# EAGLE schematic Rocketv2Backup (EAGLE 8.5.2)

## Sheet 1 of 4
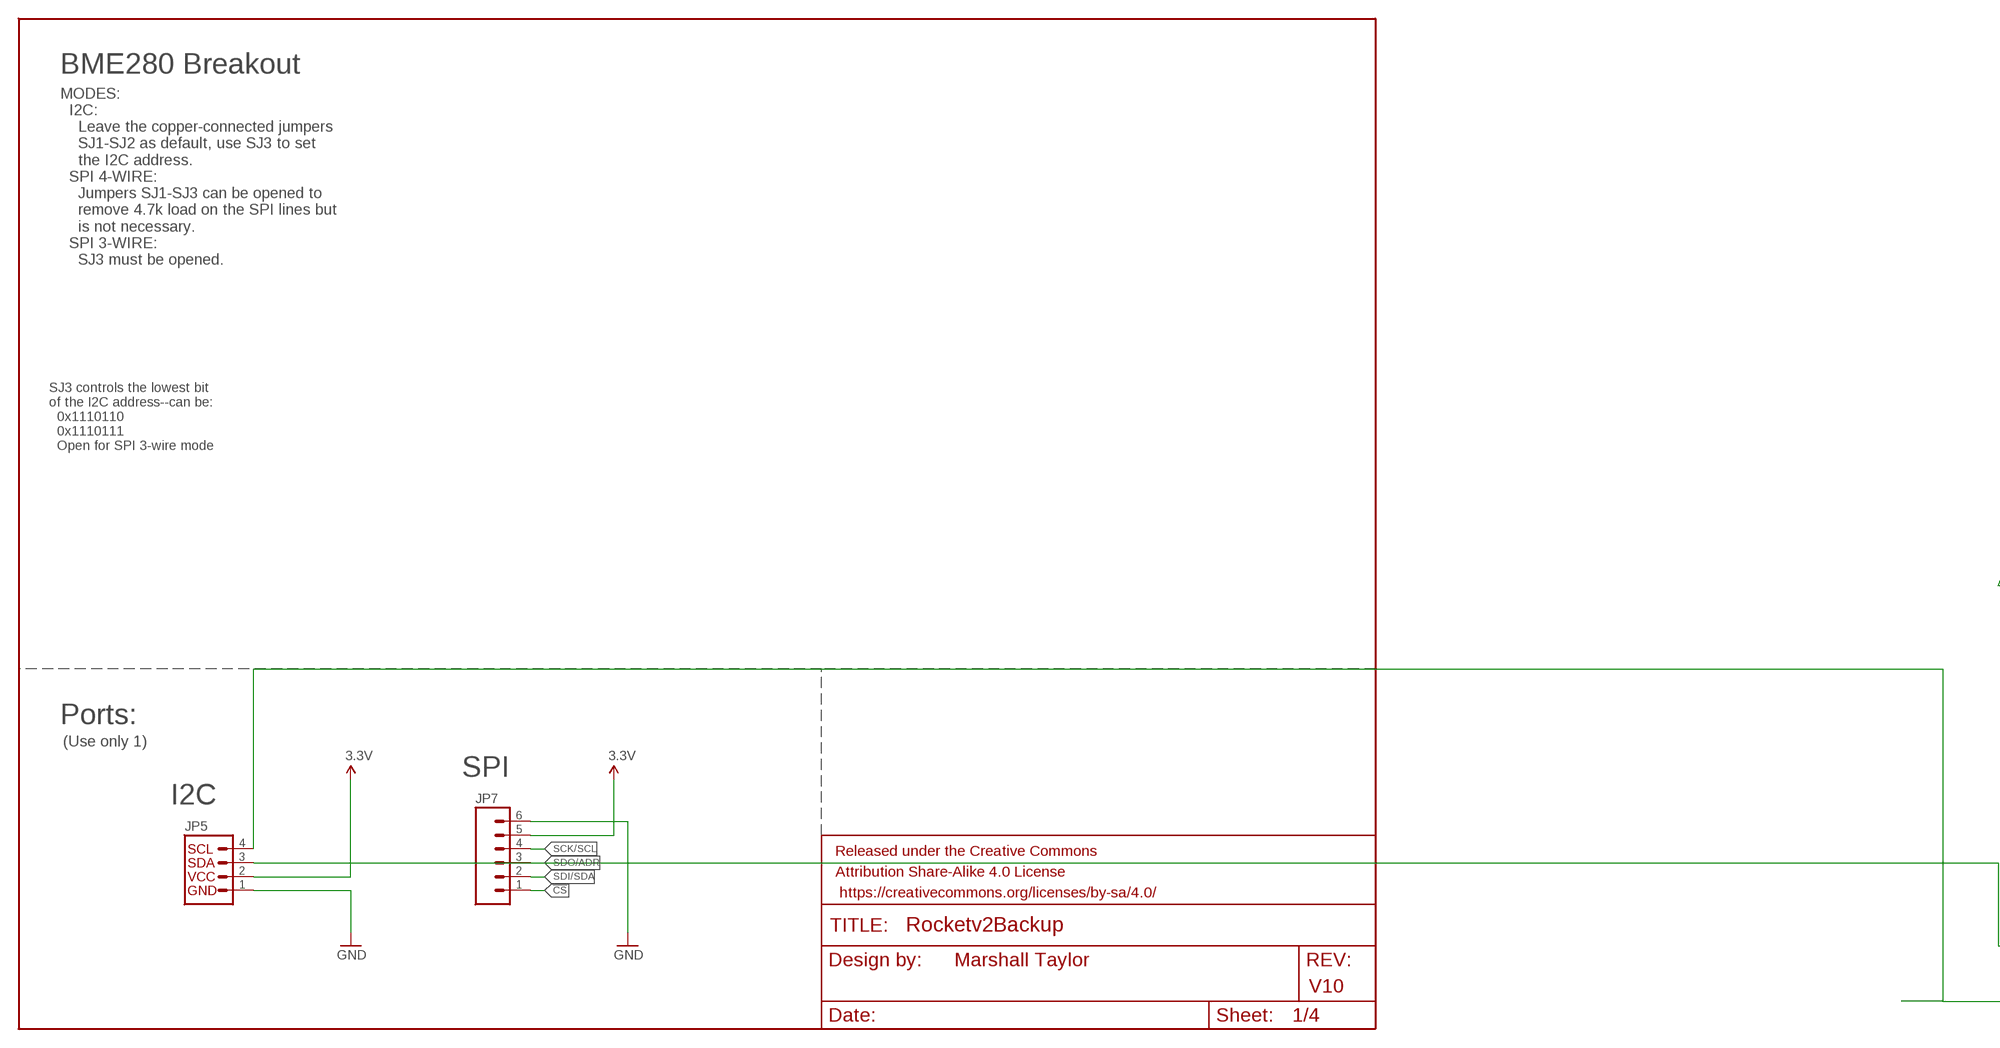
[diagram p0: schematic, sheet 1, part 1 of 2]
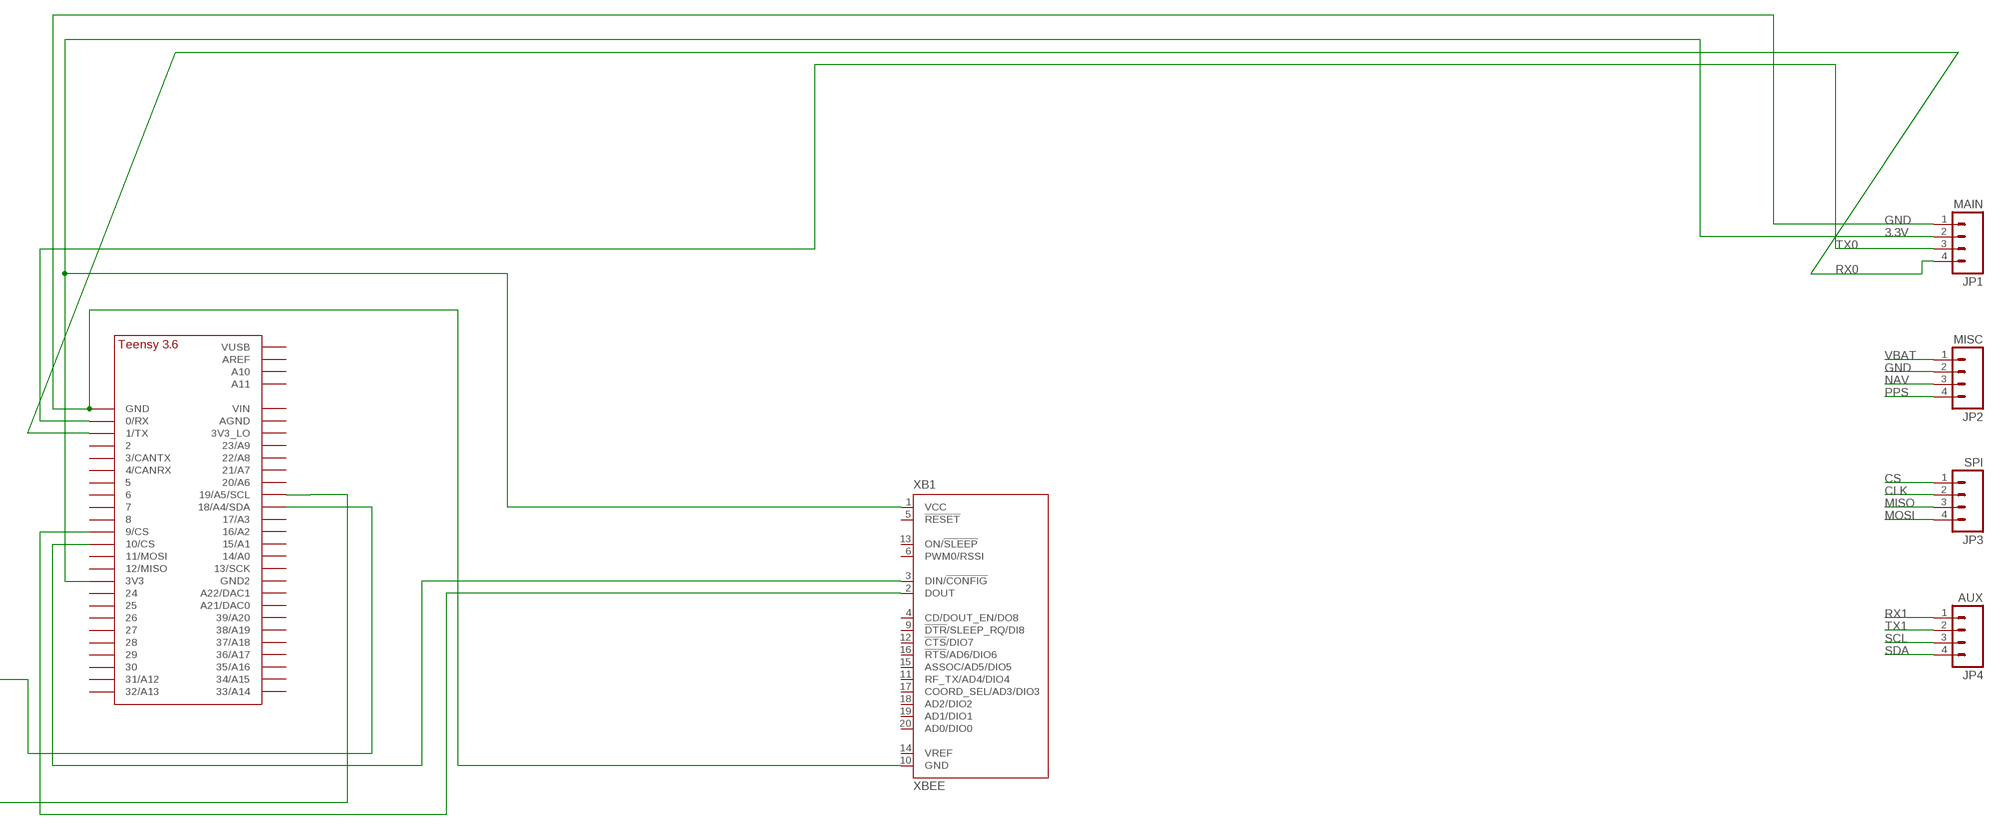
[diagram p1: schematic, sheet 1, part 2 of 2]

### Parts
FRAME3  FRAME-LETTER  [CREATIVE_COMMONS]
JP1  MAIN  M04PTH  [1X04]
JP2  MISC  M04PTH  [1X04]
JP3  SPI  M04PTH  [1X04]
JP4  AUX  M04PTH  [1X04]
JP5  I2C_STANDARD_NO_SILK  [1X04_NO_SILK]
JP7  M06NO_SILK_FEMALE_PTH  [1X06_NO_SILK]
U$1  TEENSY_3.5/3.6_BASIC  [TEENSY_3.5/3.6_BASIC]
XB1  XBEE  [XBEE]

### Nets
3.3V: JP1.2 JP5.2 JP7.5 U$1.3V3 XB1.1(VCC)
!CS: JP7.1
CLK: JP3.2
CS: JP3.1
GND: JP1.1 JP2.2 JP5.1 JP7.6 U$1.GND XB1.10(GND) ; also sheet 3
MISO: JP3.3
MOSI: JP3.4
N$5: JP5.4 U$1.19/A5/SCL
N$6: U$1.10/CS XB1.3(DIN/!CONFIG)
N$7: U$1.9/CS XB1.2(DOUT)
NAV: JP2.3
PPS: JP2.4
RX0: JP1.4 U$1.1/TX
RX1: JP4.1
SCK/SCL: JP7.4
SCL: JP4.3 ; also sheet 3
SDA: JP4.4 ; also sheet 3
SDI/SDA: JP5.3 JP7.2 U$1.18/A4/SDA
SDO/ADR: JP7.3
TX0: JP1.3 U$1.0/RX
TX1: JP4.2
VBAT: JP2.1
Unconnected: U$1.2 U$1.3/CANTX U$1.3V3_LO U$1.4/CANRX U$1.5 U$1.6 U$1.7 U$1.8 U$1.11/MOSI U$1.12/MISO U$1.13/SCK U$1.14/A0 U$1.15/A1 U$1.16/A2 U$1.17/A3 U$1.20/A6 U$1.21/A7 U$1.21/DAC0(A21/DAC0) U$1.22/A8 U$1.23/A9 U$1.24 U$1.25 U$1.26 U$1.27 U$1.28 U$1.29 U$1.30 U$1.31/A12 U$1.32/A13 U$1.33/A14 U$1.34/A15 U$1.35/A16 U$1.36/A17 U$1.37/A18 U$1.38/A19 U$1.39/A20 U$1.A10 U$1.A11 U$1.A22/DAC1 U$1.AGND U$1.AREF U$1.GND2 U$1.VIN U$1.VUSB XB1.4(CD/DOUT_EN/DO8) XB1.5(!RESET) XB1.6(PWM0/RSSI) XB1.9(!DTR!/SLEEP_RQ/DI8) XB1.11(RF_TX/AD4/DIO4) XB1.12(!CTS!/DIO7) XB1.13(ON/!SLEEP) XB1.14(VREF) XB1.15(ASSOC/AD5/DIO5) XB1.16(!RTS!/AD6/DIO6) XB1.17(COORD_SEL/AD3/DIO3) XB1.18(AD2/DIO2) XB1.19(AD1/DIO1) XB1.20(AD0/DIO0)

### Notes on the sheet
- BME280 Breakout
- MODES:
    I2C:
      Leave the copper-connected jumpers
      SJ1-SJ2 as default, use SJ3 to set
      the I2C address.
    SPI 4-WIRE:
      Jumpers SJ1-SJ3 can be opened to 
      remove 4.7k load on the SPI lines but
      is not necessary.
    SPI 3-WIRE:
      SJ3 must be opened.
- SJ3 controls the lowest bit
  of the I2C address--can be:
    0x1110110
    0x1110111
    Open for SPI 3-wire mode
- Ports:
- (Use only 1)
- SPI
- I2C
- Marshall Taylor
- V10

## Sheet 2 of 4
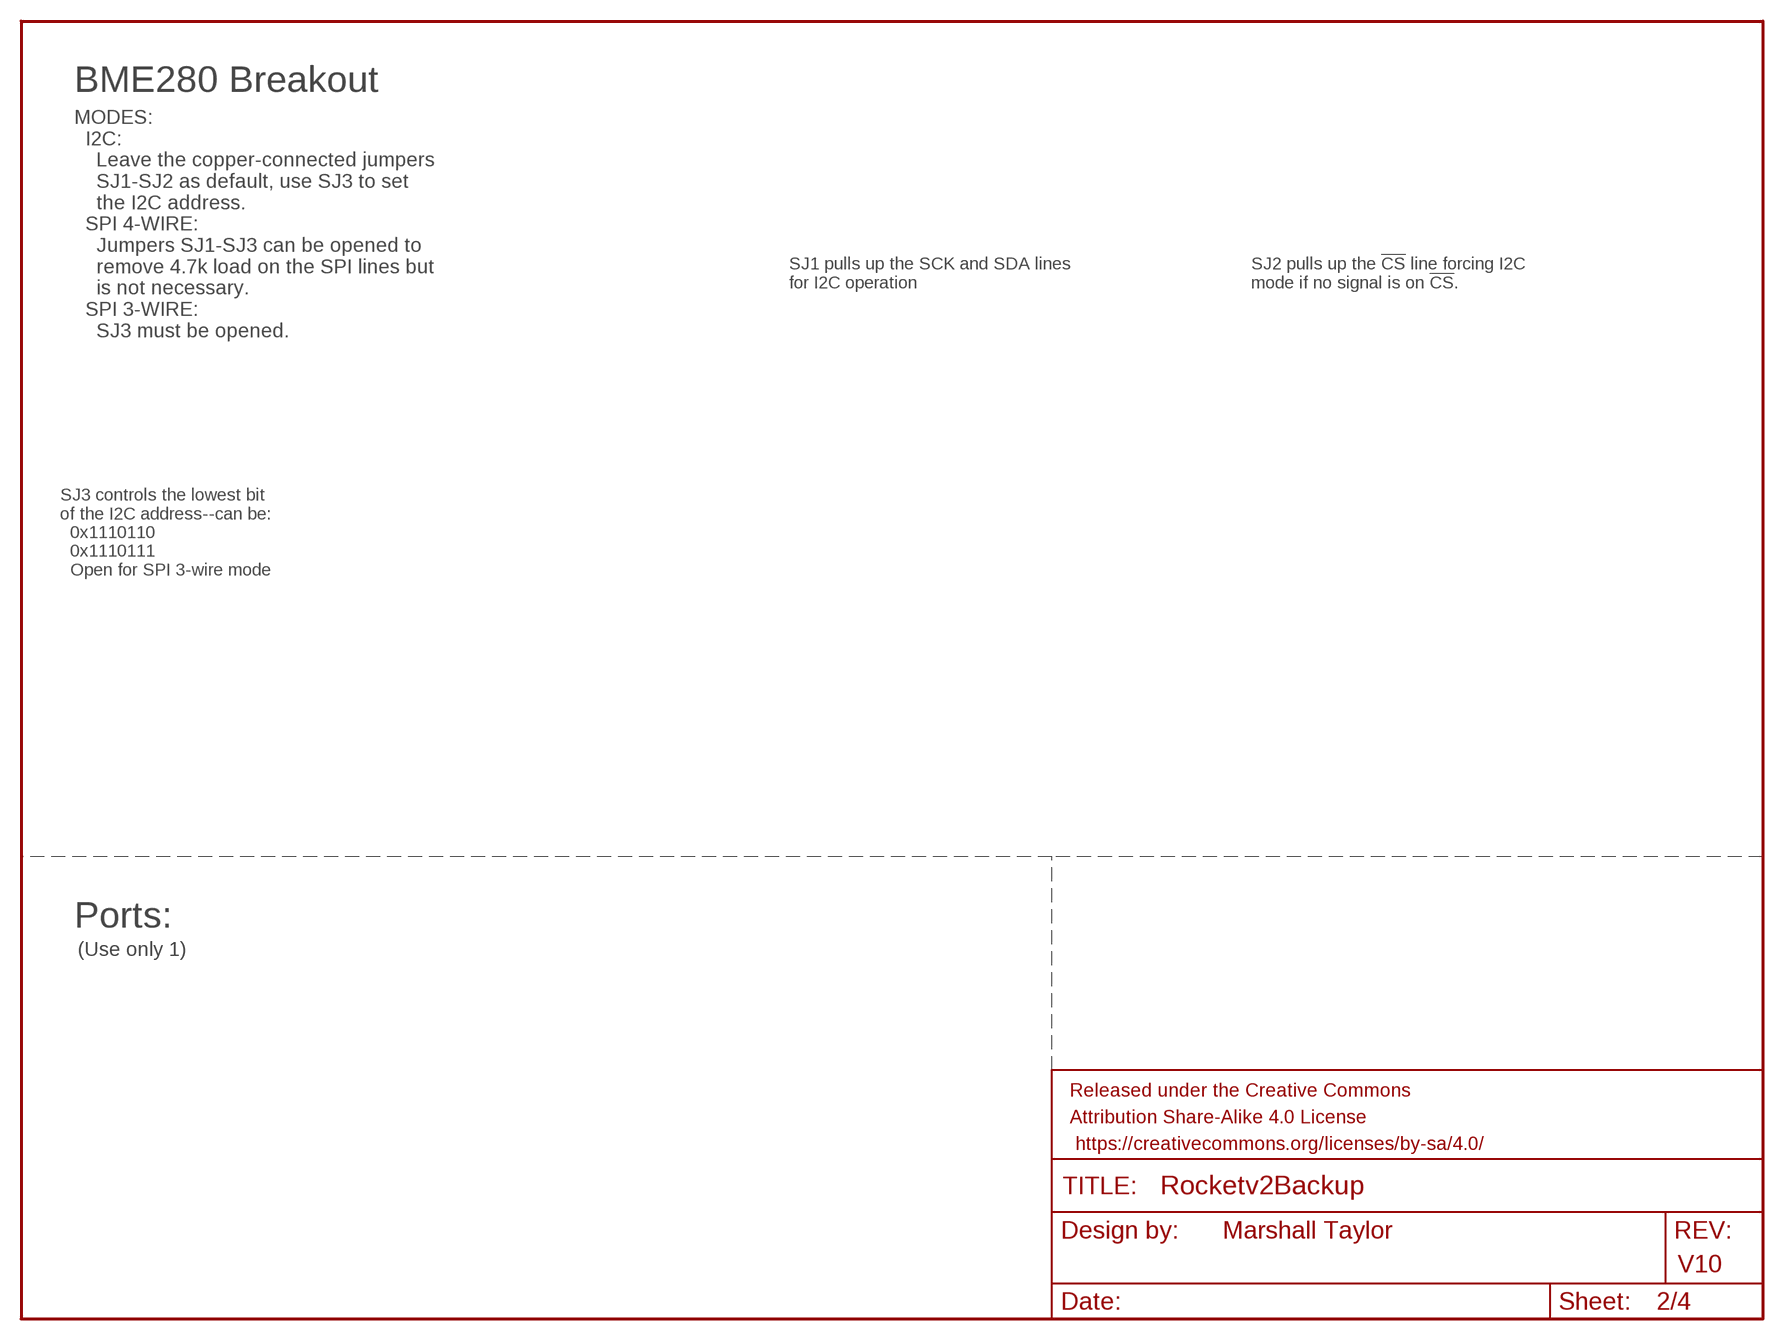
[diagram p2: schematic, sheet 2]

### Parts
FRAME1  FRAME-LETTER  [CREATIVE_COMMONS]

### Notes on the sheet
- BME280 Breakout
- MODES:
    I2C:
      Leave the copper-connected jumpers
      SJ1-SJ2 as default, use SJ3 to set
      the I2C address.
    SPI 4-WIRE:
      Jumpers SJ1-SJ3 can be opened to 
      remove 4.7k load on the SPI lines but
      is not necessary.
    SPI 3-WIRE:
      SJ3 must be opened.
- SJ1 pulls up the SCK and SDA lines
  for I2C operation
- SJ2 pulls up the !CS! line forcing I2C
  mode if no signal is on !CS!.
- SJ3 controls the lowest bit
  of the I2C address--can be:
    0x1110110
    0x1110111
    Open for SPI 3-wire mode
- Ports:
- (Use only 1)
- Marshall Taylor
- V10

## Sheet 3 of 4
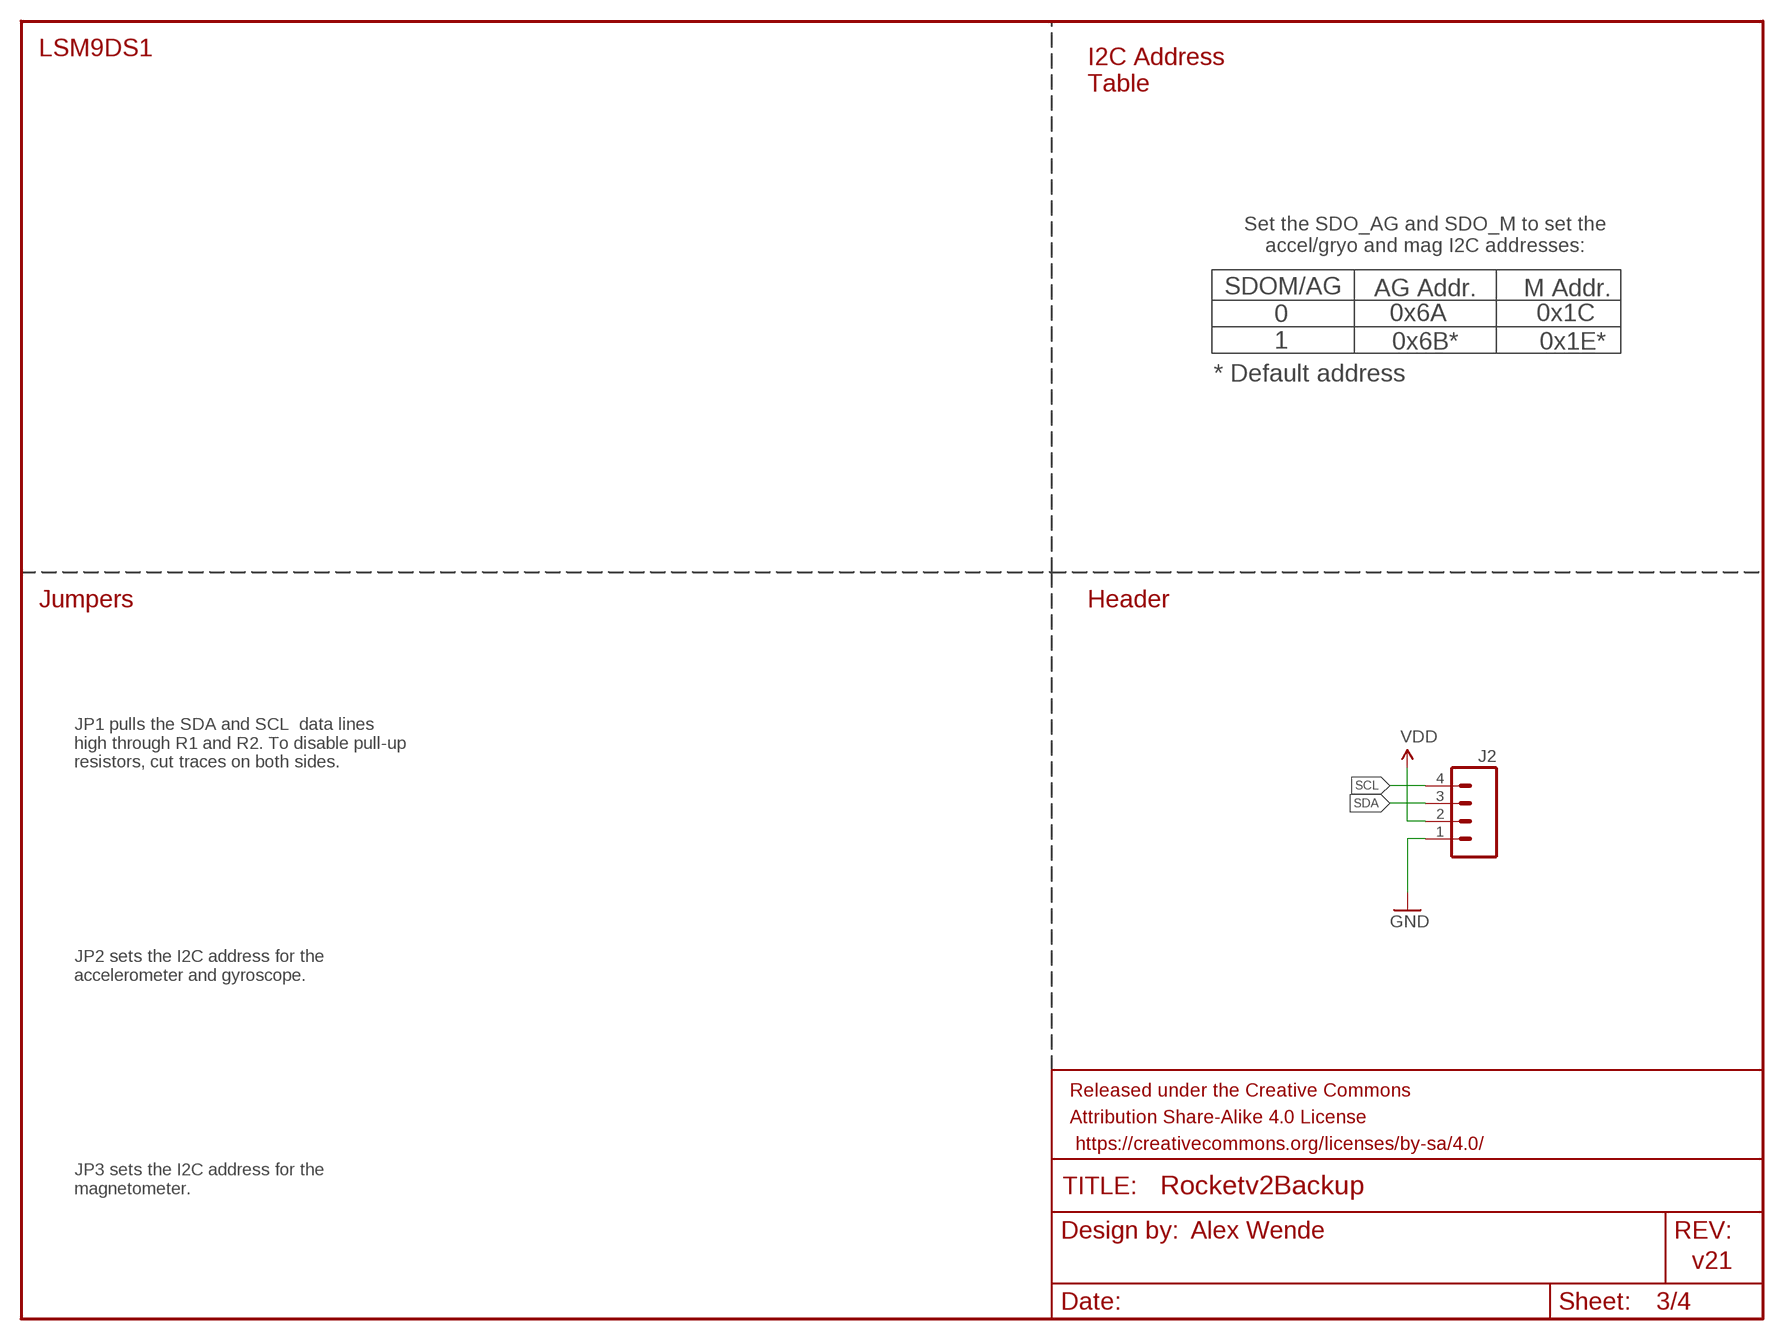
[diagram p3: schematic, sheet 3]

### Parts
FRAME2  FRAME-LETTER  [CREATIVE_COMMONS]
J2  M04NO_SILK_ALL_ROUND  [1X04_NO_SILK_ALL_ROUND]

### Nets
GND: J2.1 ; also sheet 1
SCL: J2.4 ; also sheet 1
SDA: J2.3 ; also sheet 1
VDD: J2.2

### Notes on the sheet
- LSM9DS1
- I2C Address
  Table
- Set the SDO_AG and SDO_M to set the
  accel/gryo and mag I2C addresses:
- SDOM/AG | AG Addr. | M Addr.
- 0x6A | 0x1C
- 0
  1
- 0x6B* | 0x1E*
- * Default address
- Jumpers | Header
- JP1 pulls the SDA and SCL  data lines
  high through R1 and R2. To disable pull-up
  resistors, cut traces on both sides.
- JP2 sets the I2C address for the
  accelerometer and gyroscope.
- JP3 sets the I2C address for the
  magnetometer.
- Alex Wende
- v21

## Sheet 4 of 4

## Library data of the parts
FRAME1-FRAME3 = SparkFun-Aesthetics:FRAME-LETTER: Schematic Frame Standard 8.5x11 US Letter frame
J2 = SparkFun-Connectors:M04: Header 4 Standard 4-pin 0.1" header. Use with straight break away headers (SKU : PRT-00116), right angle break away headers (PRT-00553), swiss pins (PRT-00743), machine pins (PRT-00117), and female headers (PRT-00115). Molex polarized connector foot print use with SKU : PRT-08231 with associated crimp pins and housings. 1MM SMD Version SKU: PRT-10208; PROD_ID: CONN-09696
JP1-JP4 = SparkFun:M04: Header 4 Standard 4-pin 0.1" header. Use with straight break away headers (SKU : PRT-00116), right angle break away headers (PRT-00553), swiss pins (PRT-00743), machine pins (PRT-00117), and female headers (PRT-00115). Molex polarized connector foot print use with SKU : PRT-08231 with associated crimp pins and housings. 1MM SMD Version SKU: PRT-10208
JP5 = SparkFun-Connectors:I2C_STANDARD: SparkFun has standardized on a pinout for all I2C based sensor breakouts. This pinout allows I2C boards to be plugged directly into the headers on Arduino Uno compatible boards, and to be daisy chained easily.
JP7 = SparkFun-Connectors:M06: Header 6 Standard 6-pin 0.1" header. Use with straight break away headers (SKU : PRT-00116), right angle break away headers (PRT-00553), swiss pins (PRT-00743), machine pins (PRT-00117), and female headers (PRT-00115). Molex polarized connector foot print use with SKU : PRT-08094 with associated crimp pins and housings. NOTES ON THE VARIANTS LOCK and LOCK_LONGPADS... This footprint was designed to help hold the alignment of a through-hole component (i.e. 6-pin header) while soldering it into place. You may notice that each hole has been shifted either up or down by 0.005 of an inch from it's more standard position (which is a perfectly straight line). This slight alteration caused the pins (the squares in the middle) to touch the edges of the holes. Because they are alternating, it causes a "brace" to hold the component in place. 0.005 has proven to be the perfect amount of "off-center" position when using our standard breakaway headers. Although looks a little odd when you look at the bare footprint, once you have a header in there, the alteration is very hard to notice. Also,if you push a header all the way into place, it is covered up entirely on the bottom side. This idea of altering the position of holes to aid alignment will be further integrated into the Sparkfun Library for other footprints. It can help hold any component with 3 or more connection pins.; PROD_ID: CONN-08437
U$1 = Teensy356:TEENSY_3.5/3.6_BASIC
XB1 = maxstream:XBEE: XBee (TM) /XBee-PRO(TM) OEM RF Modules Source: MaxStream, Inc. xbee_productmanual.pdf; MPN: XBP24-Z7UIT-004; OC_FARNELL: 1751799; OC_NEWARK: 34R5507

## Net classes
1 vcc: width 0.305 mm